# EasyEDA Pro project DRG ST-5 STM32H750VBT6 V1.0_001.eprj

# Schematic DRG ST-5 STM32H750VBT6 V1.0_001
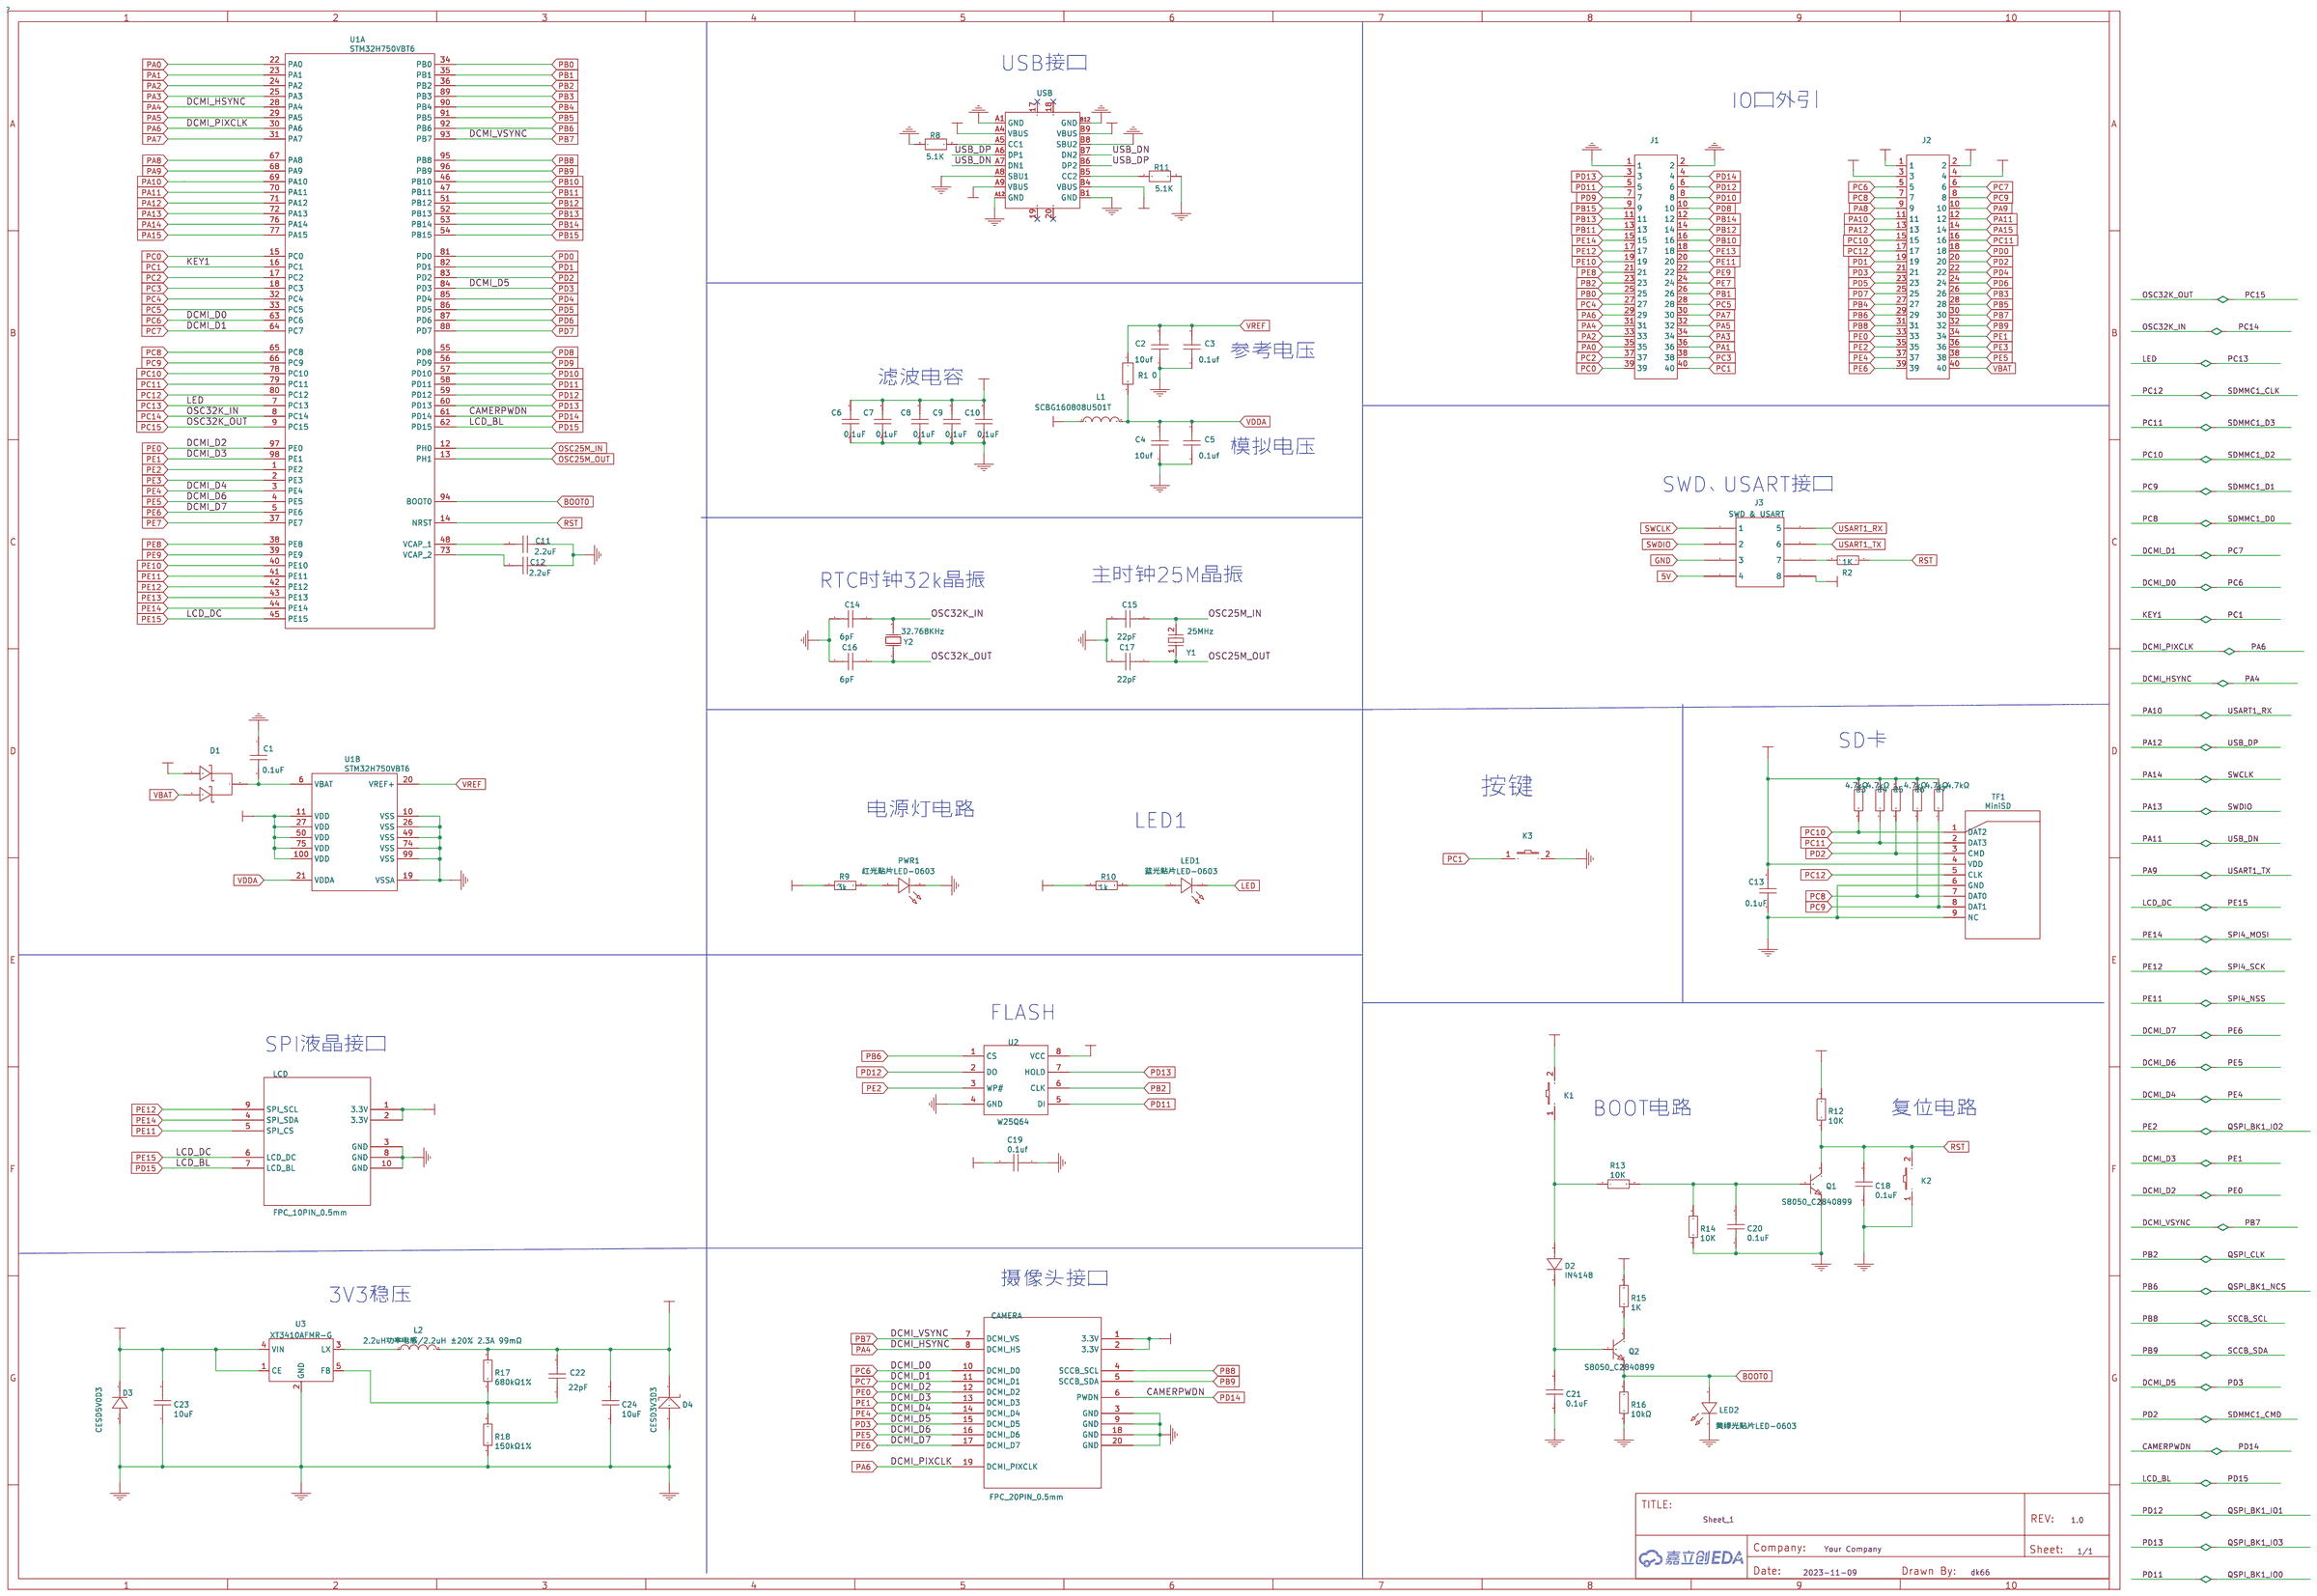
[diagram p0: schematic sheet]

## Parts
C1  0.1uF  [C0603]
C2  10uf  [C0603]
C3  0.1uf  [C0603]
C4  10uf  [C0603]
C5  0.1uf  [C0603]
C6  0.1uF  [C0603]
C7  0.1uF  [C0603]
C8  0.1uF  [C0603]
C9  0.1uF  [C0603]
C10  0.1uF  [C0603]
C11  2.2uF  [C0603]
C12  2.2uF  [C0603]
C13  0.1uF  [C0603]
C14  6pF  [C0603]
C15  22pF  [C0603]
C16  6pF  [C0603]
C17  22pF  [C0603]
C18  0.1uF  [C0603]
C19  0.1uf  [C0603]
C20  0.1uF  [C0603]
C21  0.1uF  [C0603]
C22  22pF  [10UF-C0603]
C23  10uF  [10UF-C0603]
C24  10uF  [10UF-C0603]
CAMERA  FPC_20PIN_0.5mm  [CAMERA]
D1  LBAT54CLT1G  [SOT-23-3_L2.9-W1.3-P1.90-LS2.4-BR]
D2  IN4148  [LL-34_L3.4-W1.5-RD]
D3  CESD5V0D3  [SOD-323_L1.7-W1.3-LS2.6-RD-2]
D4  CESD3V3D3  [SOD-323_L1.8-W1.3-LS2.5-RD]
J1  X6521WV-2×20H-C30D60  [HDR-TH_40P-2.54-V-M-R2-C20-S2.54]
J2  X6521WV-2×20H-C30D60  [HDR-TH_40P-2.54-V-M-R2-C20-S2.54]
J3  SWD & USART  [2X4P-FANKE]
K1  K2-3.6×6.1_SMD  [SW-SMD_L3.9-W3.0-P4.45]
K2  K2-3.6×6.1_SMD  [SW-SMD_L3.9-W3.0-P4.45]
K3  K2-3.6×6.1_SMD  [SW-SMD_L3.9-W3.0-P4.45]
L1  SCBG160808U501T  [L0603]
L2  2.2uH功率电感/2.2uH ±20% 2.3A 99mΩ  [IND-SMD_L2.5-W2.0]
LCD  FPC_10PIN_0.5mm  [FPC10P-0.5MM]
LED1  蓝光贴片LED-0603  [LED0603-RD_RED]
LED2  黄绿光贴片LED-0603  [LED0603-RD_RED]
PWR1  红光贴片LED-0603  [LED0603-RD_RED]
Q1  S8050_C2840899  [SOT-23-3_L2.9-W1.3-P1.90-LS2.4-BR]
Q2  S8050_C2840899  [SOT-23-3_L2.9-W1.3-P1.90-LS2.4-BR]
R1  0  [R0603]
R2  1K  [R0603]
R3  4.7kΩ  [R0603]
R4  4.7kΩ  [R0603]
R5  4.7kΩ  [R0603]
R6  4.7kΩ  [R0603]
R7  4.7kΩ  [R0603]
R8  5.1K  [R0603]
R9  3k  [R0603]
R10  1k  [R0603]
R11  5.1K  [R0603]
R12  10K  [R0603]
R13  10K  [R0603]
R14  10K  [R0603]
R15  1K  [R0603]
R16  10kΩ  [R0603]
R17  680kΩ1%  [R0603]
R18  150kΩ1%  [R0603]
TF1  MiniSD  [MINISD]
U1  STM32H750VBT6  [LQFP-100_14X14X05P]  (sections 1,2)
U2  W25Q64  [SOIC-8_L5.3-W5.3-P1.27-LS8.0-BL]
U3  XT3410AFMR-G  [SOT-23-5_L3.0-W1.7-P0.95-LS2.8-BL]
USB  TYPE-C16PIN母座 板上四脚三次MOLDING  [USB-SMD_TYPE-C16PIN COPY COPY]
Y1  25MHz  [CRYSTAL-SMD_L5.0-W3.2]
Y2  32.768KHz  [OSC-SMD_L3.2-W1.5]

## Library data of the parts
C1 C6-C10 C13 C18 C20 C21 = 0.1uF: Supplier Part: C2168571; Supplier: LCSC; Manufacturer Part: 0603BB104K500NGT; Manufacturer: Knowles(楼氏); JLCPCB Part Class: Extended Part
C2 C4 = 10uf
C3 C5 C19 = 0.1uf
C11 C12 = 2.2uF: Supplier: LCSC; Supplier Part: C458915; Manufacturer: Walsin Tech Corp; Manufacturer Part: 0603X225M6R3CT; JLCPCB Part Class: Extended Part
C14 C16 = 6pF: Supplier: LCSC; Supplier Part: C307356; Manufacturer: Samsung Electro-Mechanics; Manufacturer Part: CL10C100JB81PNC
C15 C17 = 22pF: Supplier: LCSC; Supplier Part: C307356; Manufacturer: Samsung Electro-Mechanics; Manufacturer Part: CL10C100JB81PNC
C22 = 22pF: Supplier: LCSC; Supplier Part: C15415; Manufacturer: Samsung Electro-Mechanics
C23 C24 = 10uF: Supplier: LCSC; Supplier Part: C15415; Manufacturer: Samsung Electro-Mechanics
CAMERA = FPC_20PIN_0.5mm
D1 = LBAT54CLT1G: Supplier: LCSC; Manufacturer: LRC(乐山无线电); Supplier Part: C49991; JLCPCB Part Class: Extended Part
D2 = IN4148: Supplier: LCSC; Supplier Part: C9900023201; Manufacturer: null; JLCPCB Part Class: Extended Part
D3 = CESD5V0D3: Supplier: LCSC; Supplier Part: C2910104; Manufacturer: CJ(江苏长电/长晶); JLCPCB Part Class: Extended Part; link: https://so.szlcsc.com/global.html?k=C2910104&ref=editor
D4 = CESD3V3D3: Supplier: LCSC; Manufacturer: CJ(江苏长电/长晶); Manufacturer Part: CESD3V3D3 YU; Supplier Part: C38388; JLCPCB Part Class: Extended Part
J1 J2 = X6521WV-2×20H-C30D60: Supplier: LCSC; Supplier Part: C725892; Manufacturer: XKB Connectivity(中国星坤); Manufacturer Part: X6521WV-2x20H-C30D60; JLCPCB Part Class: Extended Part
J3 = SWD & USART
K1-K3 = K2-3.6×6.1_SMD: Supplier Part: C118141; Supplier: LCSC; Manufacturer Part: K2-1107ST-A4SW-06; 制造商: 韩国韩荣
L1 = SCBG160808U501T: Supplier: LCSC; Supplier Part: C480859; Manufacturer: Yanchuang(研创); JLCPCB Part Class: Extended Part
L2 = 2.2uH功率电感/2.2uH ±20% 2.3A 99mΩ: Supplier: LCSC; Supplier Part: C315713; Manufacturer: INPAQ(佳邦); Manufacturer Part: WIP252010P-2R2ML; JLCPCB Part Class: Extended Part; link: https://so.szlcsc.com/global.html?k=C315713&ref=editor
LCD = FPC_10PIN_0.5mm
LED1 = 蓝光贴片LED-0603: Supplier: LCSC; Supplier Part: C9900005782; Manufacturer: null; Manufacturer Part: 红光贴片LED-0603; JLCPCB Part Class: Extended Part
LED2 = 黄绿光贴片LED-0603: Supplier: LCSC; Supplier Part: C9900005782; Manufacturer: null; Manufacturer Part: 红光贴片LED-0603; JLCPCB Part Class: Extended Part
PWR1 = 红光贴片LED-0603: Supplier: LCSC; Supplier Part: C9900005782; Manufacturer: null; JLCPCB Part Class: Extended Part
Q1 Q2 = S8050_C2840899: Supplier: LCSC; Supplier Part: C2840899; Manufacturer: PSI(宝力芯); Manufacturer Part: S8050; JLCPCB Part Class: Extended Part; link: https://so.szlcsc.com/global.html?k=C2840899&ref=editor
R1 = 0
R2 = 1K: Supplier: LCSC; Supplier Part: C328340; Manufacturer: ResistorToday; Manufacturer Part: AECR0603F1K00K9; JLCPCB Part Class: Extended Part
R3-R7 = 4.7kΩ: Supplier: LCSC; Supplier Part: C269694; Manufacturer: Tyohm; Manufacturer Part: RMC06034.7k5%N; Resistance: 4.7K; JLCPCB Part Class: Extended Part
R8 R11 = 5.1K
R9 = 3k: Supplier: LCSC; Manufacturer: LIZ; Manufacturer Part: CR0603FA4701G; Supplier Part: C101062
R10 = 1k: Supplier: LCSC; Manufacturer: LIZ; Manufacturer Part: CR0603FA4701G; Supplier Part: C101062
R12-R14 = 10K: Supplier: LCSC; Supplier Part: C328422; Manufacturer: ResistorToday; Manufacturer Part: PTFR0603B1K00P9
R15 = 1K: Supplier: LCSC; Supplier Part: C328422; Manufacturer: ResistorToday; Manufacturer Part: PTFR0603B1K00P9
R16 = 10kΩ: Supplier: LCSC; Supplier Part: C328417; Manufacturer: ResistorToday; Manufacturer Part: PTFR0402B10K0N9; Resistance: 10K; JLCPCB Part Class: Extended Part
R17 = 680kΩ1%: Supplier: LCSC; Supplier Part: C328417; Manufacturer: ResistorToday; Manufacturer Part: PTFR0402B10K0N9; Resistance: 10K; JLCPCB Part Class: Extended Part
R18 = 150kΩ1%: Supplier: LCSC; Supplier Part: C328417; Manufacturer: ResistorToday; Manufacturer Part: PTFR0402B10K0N9; Resistance: 10K; JLCPCB Part Class: Extended Part
TF1 = MiniSD
U1 = STM32H750VBT6: Supplier Part: C117815; Supplier: LCSC; Manufacturer: STMicroelectronics; Manufacturer Part: STM32F427VGT6
U2 = W25Q64: Supplier: LCSC; Manufacturer Part: ?; Supplier Part: C110643
U3 = XT3410AFMR-G: Supplier: LCSC; Supplier Part: C190829; Manufacturer: natlinear(南麟); JLCPCB Part Class: Extended Part
USB = TYPE-C16PIN母座 板上四脚三次MOLDING: Supplier: LCSC; Supplier Part: C9900000202; Manufacturer: null; Manufacturer Part: TYPE-C16PIN母座 板上四脚三次molding; JLCPCB Part Class: Extended Part; link: https://so.szlcsc.com/global.html?k=C9900000202&ref=editor
Y1 = 25MHz: Supplier: LCSC; Supplier Part: C1986844; Manufacturer: NDK; Manufacturer Part: NX5032GA-25MHZ-EXS00A-CG07041; JLCPCB Part Class: Extended Part; link: https://so.szlcsc.com/global.html?k=C1986844&ref=editor
Y2 = 32.768KHz: Supplier: LCSC; Supplier Part: C280830; Manufacturer: Nihon Dempa Kogyo; Manufacturer Part: EXS00A-MU00202

## Nets
3V3: C6.2 C7.2 C8.2 C9.2 C10.2 C13.2 C19.2 C22.2 C24.2 CAMERA.1(3.3V) CAMERA.2(3.3V) D1.1(A1) D4.1 J2.3 J2.4 J3.8 K1.2 L1.1 L2.2 LCD.1(3.3V) LCD.2(3.3V) R3.1 R4.2 R5.2 R6.2 R7.2 R9.1 R10.1 R12.2 R15.1 R17.2 TF1.4(VDD) U1.11(VDD) U1.27(VDD) U1.50(VDD) U1.75(VDD) U1.100(VDD) U2.8(VCC)
5V: C23.2 D3.1(K) J2.1 J2.2 J3.4 U3.1(CE) U3.4(VIN) USB.A4(VBUS) USB.A9(VBUS) USB.B4(VBUS) USB.B9(VBUS)
GND: C1.1 C2.1 C3.1 C4.1 C5.1 C6.1 C7.1 C8.1 C9.1 C10.1 C11.2 C12.1 C13.1 C14.2 C15.2 C16.2 C17.2 C18.1 C19.1 C20.1 C21.1 C23.1 C24.1 CAMERA.3(GND) CAMERA.9(GND) CAMERA.18(GND) CAMERA.20(GND) D3.2(A) D4.2 J1.1 J1.2 J3.3 K2.1 K3.2 LCD.3(GND) LCD.8(GND) LCD.10(GND) LED2.1(K) PWR1.1(K) Q1.2(E) R8.1 R11.2 R14.2 R16.1 R18.1 TF1.6(GND) TF1.9(NC) U1.10(VSS) U1.19(VSSA) U1.26(VSS) U1.49(VSS) U1.74(VSS) U1.99(VSS) U2.4(GND) U3.2(GND) USB.A1(GND) USB.A8(SBU1) USB.A12(GND) USB.B1(GND) USB.B8(SBU2) USB.B12(GND)
VBAT: D1.2(A2) J2.40
VDDA: C4.2 C5.2 L1.2 R1.2 U1.21(VDDA)
BOOT0: LED2.2(A) Q2.2(E) R16.2 U1.94(BOOT0)
CAMERPWDN: CAMERA.6(PWDN) J1.4 U1.61(PD14)
DCMI_D0: CAMERA.10(DCMI_D0) J2.5 U1.63(PC6)
DCMI_D1: CAMERA.11(DCMI_D1) J2.6 U1.64(PC7)
DCMI_D2: CAMERA.12(DCMI_D2) J2.33 U1.97(PE0)
DCMI_D3: CAMERA.13(DCMI_D3) J2.34 U1.98(PE1)
DCMI_D4: CAMERA.14(DCMI_D4) J2.37 U1.3(PE4)
DCMI_D5: CAMERA.15(DCMI_D5) J2.21 U1.84(PD3)
DCMI_D6: CAMERA.16(DCMI_D6) J2.38 U1.4(PE5)
DCMI_D7: CAMERA.17(DCMI_D7) J2.39 U1.5(PE6)
DCMI_HSYNC: CAMERA.8(DCMI_HS) J1.31 U1.28(PA4)
DCMI_PIXCLK: CAMERA.19(DCMI_PIXCLK) J1.29 U1.30(PA6)
DCMI_VSYNC: CAMERA.7(DCMI_VS) J2.30 U1.93(PB7)
KEY1: J1.40 K3.1 U1.16(PC1)
LCD_BL: LCD.7(LCD_BL) U1.62(PD15)
LCD_DC: LCD.6(LCD_DC) U1.45(PE15)
LED: LED1.1(K) U1.7(PC13)
OSC25M_IN: C15.1 U1.12(PH0) Y1.2(GND)
OSC25M_OUT: C17.1 U1.13(PH1) Y1.1
OSC32K_IN: C14.1 U1.8(PC14) Y2.2(OSC2)
OSC32K_OUT: C16.1 U1.9(PC15) Y2.1(OSC1)
PA0: J1.35 U1.22(PA0)
PA1: J1.36 U1.23(PA1)
PA2: J1.33 U1.24(PA2)
PA3: J1.34 U1.25(PA3)
PA5: J1.32 U1.29(PA5)
PA7: J1.30 U1.31(PA7)
PA8: J2.9 U1.67(PA8)
PA9: J2.10 J3.6 U1.68(PA9)
PA10: J2.11 J3.5 U1.69(PA10)
PA11: J2.12 U1.70(PA11) USB.A7(DN1) USB.B7(DN2)
PA12: J2.13 U1.71(PA12) USB.A6(DP1) USB.B6(DP2)
PA13: J3.2 U1.72(PA13)
PA14: J3.1 U1.76(PA14)
PA15: J2.14 U1.77(PA15)
PB0: J1.25 U1.34(PB0)
PB1: J1.26 U1.35(PB1)
PB2: J1.23 U1.36(PB2) U2.6(CLK)
PB3: J2.26 U1.89(PB3)
PB4: J2.27 U1.90(PB4)
PB5: J2.28 U1.91(PB5)
PB6: J2.29 U1.92(PB6) U2.1(CS)
PB8: CAMERA.4(SCCB_SCL) J2.31 U1.95(PB8)
PB9: CAMERA.5(SCCB_SDA) J2.32 U1.96(PB9)
PB10: J1.16 U1.46(PB10)
PB11: J1.13 U1.47(PB11)
PB12: J1.14 U1.51(PB12)
PB13: J1.11 U1.52(PB13)
PB14: J1.12 U1.53(PB14)
PB15: J1.9 U1.54(PB15)
PC0: J1.39 U1.15(PC0)
PC2: J1.37 U1.17(PC2)
PC3: J1.38 U1.18(PC3)
PC4: J1.27 U1.32(PC4)
PC5: J1.28 U1.33(PC5)
PC8: J2.7 R6.1 TF1.7(DAT0) U1.65(PC8)
PC9: J2.8 R7.1 TF1.8(DAT1) U1.66(PC9)
PC10: J2.15 R3.2 TF1.1(DAT2) U1.78(PC10)
PC11: J2.16 R4.1 TF1.2(DAT3) U1.79(PC11)
PC12: J2.17 TF1.5(CLK) U1.80(PC12)
PD0: J2.18 U1.81(PD0)
PD1: J2.19 U1.82(PD1)
PD2: J2.20 R5.1 TF1.3(CMD) U1.83(PD2)
PD4: J2.22 U1.85(PD4)
PD5: J2.23 U1.86(PD5)
PD6: J2.24 U1.87(PD6)
PD7: J2.25 U1.88(PD7)
PD8: J1.10 U1.55(PD8)
PD9: J1.7 U1.56(PD9)
PD10: J1.8 U1.57(PD10)
PD11: J1.5 U1.58(PD11) U2.5(DI)
PD12: J1.6 U1.59(PD12) U2.2(DO)
PD13: J1.3 U1.60(PD13) U2.7(HOLD)
PE2: J2.35 U1.1(PE2) U2.3(WP#)
PE3: J2.36 U1.2(PE3)
PE7: J1.24 U1.37(PE7)
PE8: J1.21 U1.38(PE8)
PE9: J1.22 U1.39(PE9)
PE10: J1.19 U1.40(PE10)
PE11: J1.20 LCD.5(SPI_CS) U1.41(PE11)
PE12: J1.17 LCD.9(SPI_SCL) U1.42(PE12)
PE13: J1.18 U1.43(PE13)
PE14: J1.15 LCD.4(SPI_SDA) U1.44(PE14)
RST: C18.2 K2.2 Q1.3(C) R2.1 R12.1 U1.14(NRST)
VREF: C2.2 C3.2 R1.1 U1.20(VREF+)
D2_2: D2.2(A) K1.1 R13.1
L2_1: L2.1 U3.3(LX)
LED1_2: LED1.2(A) R10.2
PWR1_2: PWR1.2(A) R9.2
Q1_1: C20.2 Q1.1(B) R13.2 R14.1
Q2_1: C21.2 D2.1(K) Q2.1(B)
R2_2: J3.7 R2.2
R8_2: R8.2 USB.A5(CC1)
R11_1: R11.1 USB.B5(CC2)
R15_2: Q2.3(C) R15.2
R18_2: C22.1 R17.1 R18.2 U3.5(FB)
U1_6: C1.2 D1.3(K) U1.6(VBAT)
U1_48: C11.1 U1.48(VCAP_1)
U1_73: C12.2 U1.73(VCAP_2)

Not connected (* = marked no-connect by the designer): USB 17* 18* 19* 20*

## Notes on the sheet
- USB接口
- IO口外引
- 参考电压
- 滤波电容
- 模拟电压
- SWD、USART接口
- RTC时钟32k晶振
- 主时钟25M晶振
- SD卡
- 按键
- 电源灯电路
- LED1
- FLASH
- SPI液晶接口
- BOOT电路
- 复位电路
- 摄像头接口
- 3V3稳压

# Board DRG ST-5 STM32H750VBT6 V1.0_001-PCB
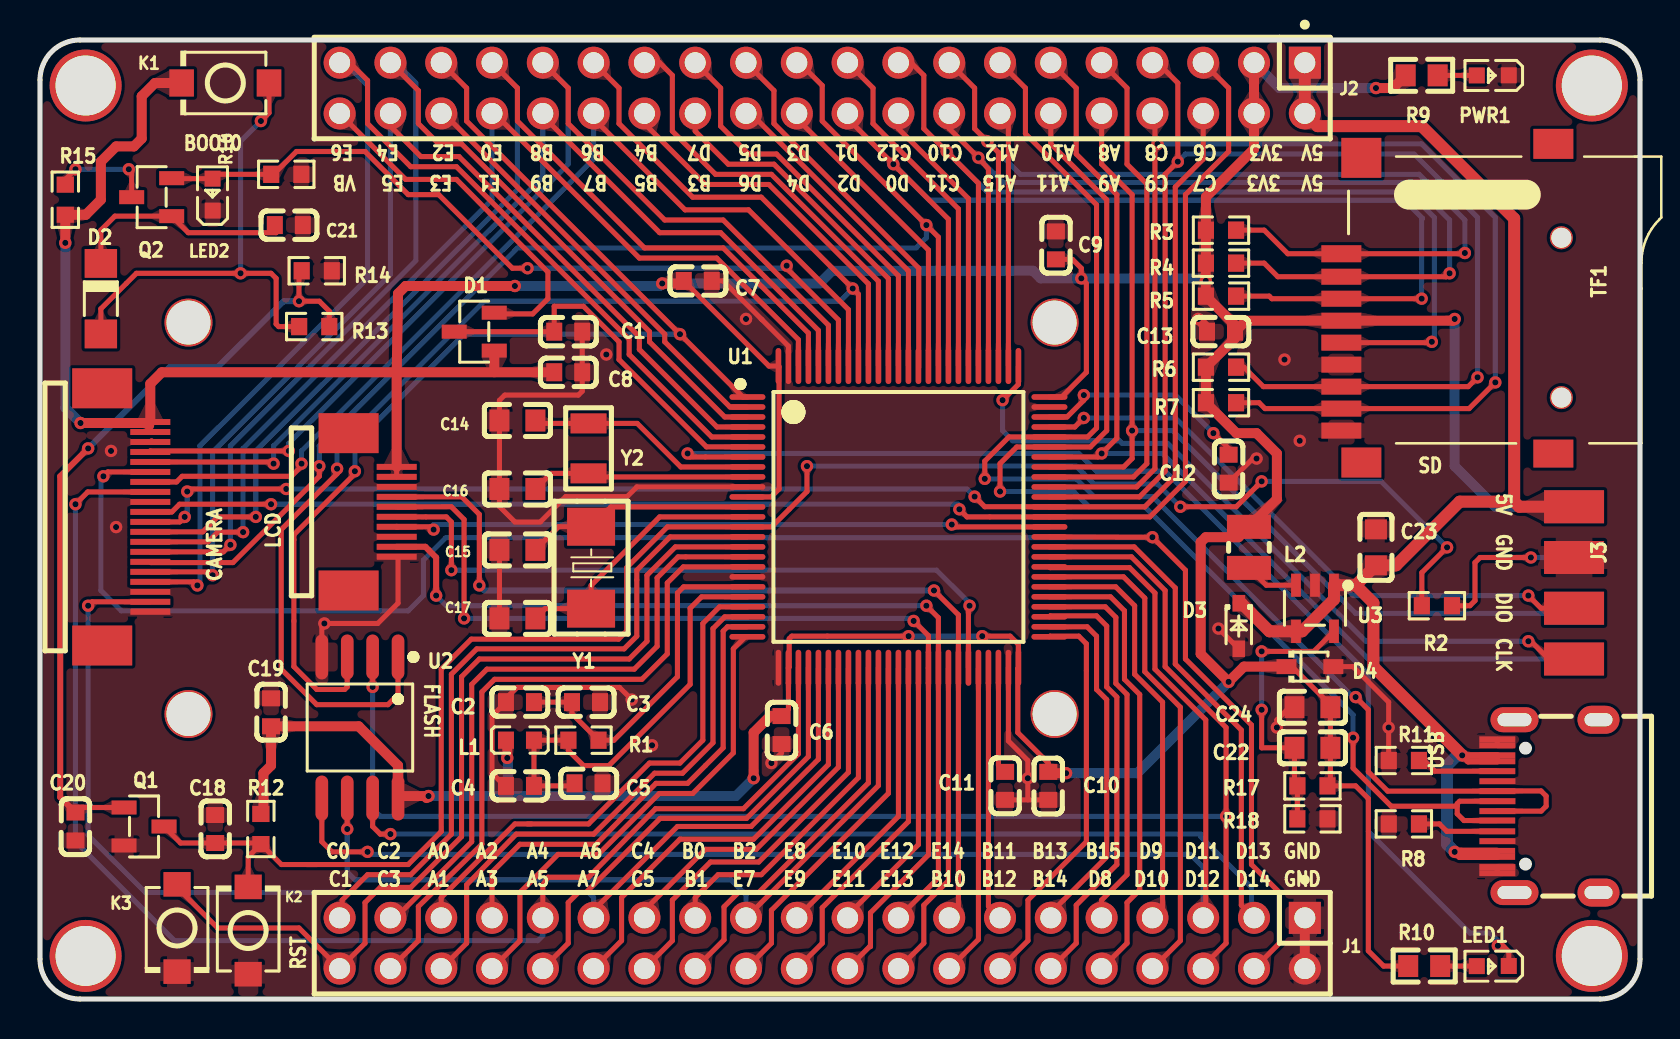
[diagram p1: board, top side]
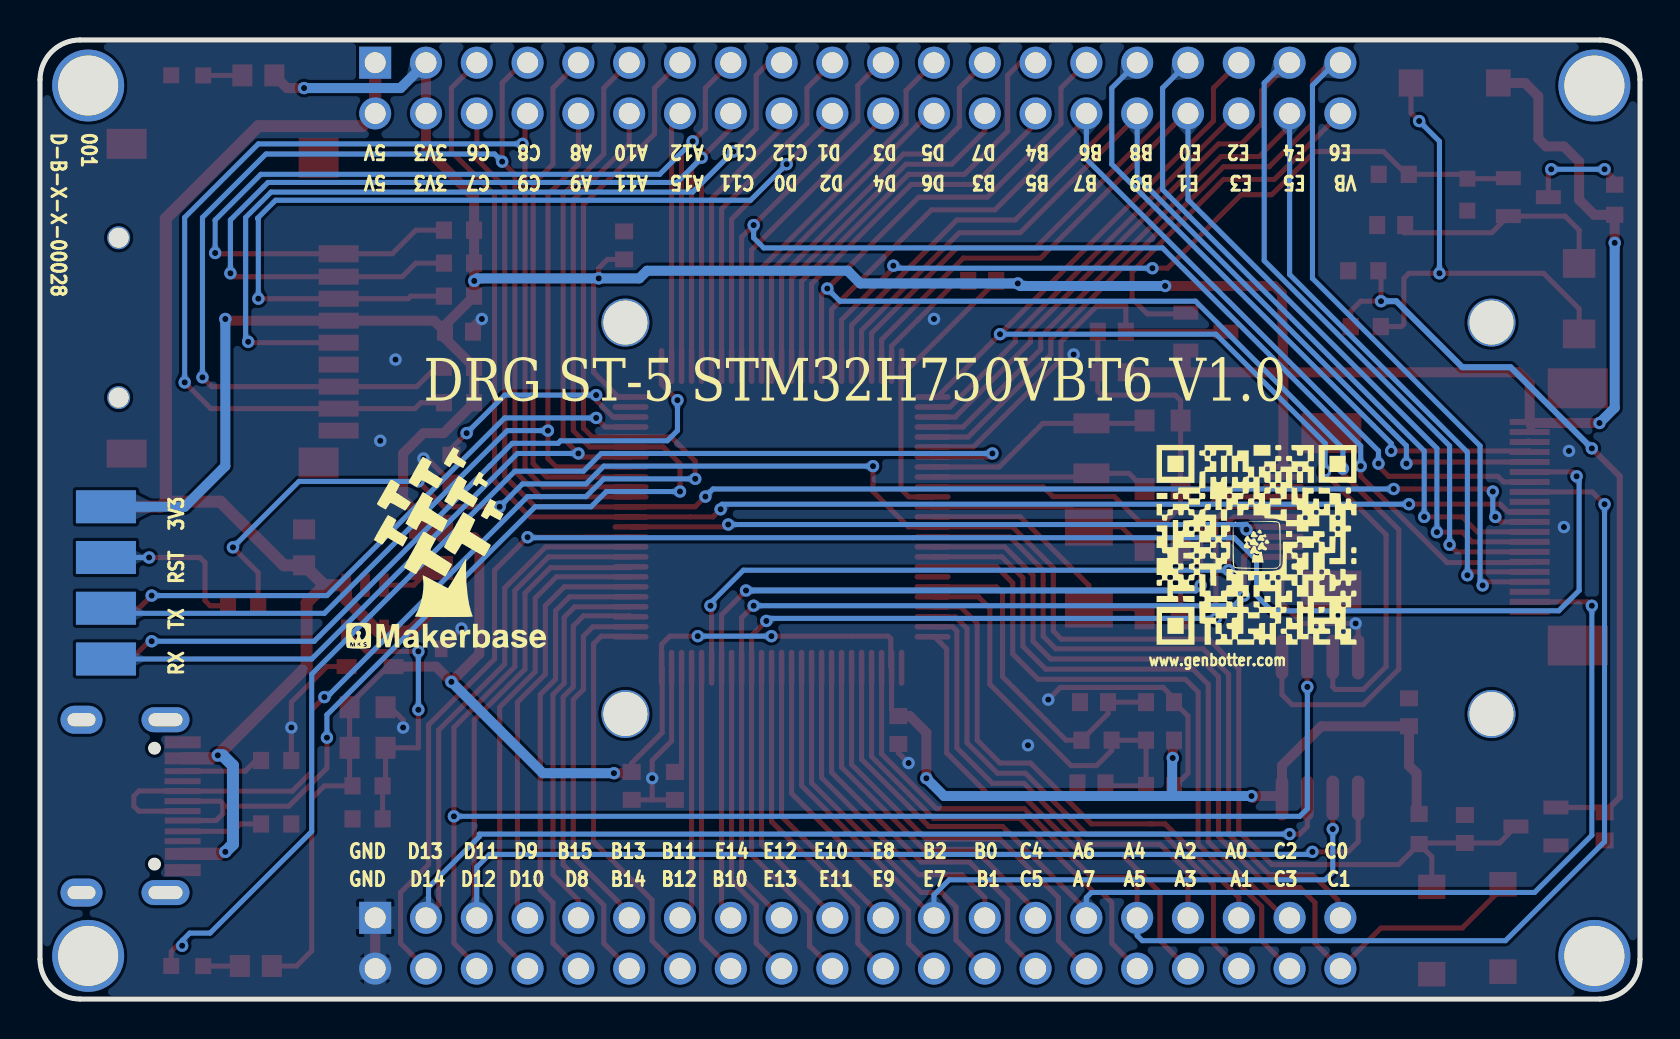
[diagram p2: board, bottom side, seen from below]

Outline 80 x 48 mm; copper layers: Top Layer, Bottom Layer. Coordinates in mm from the lower left corner of the outline.
Outline path: 0,46 arc(0.59,47.41) 2,48 78,48 arc(79.41,47.41) 80,46 80,2 arc(79.41,0.59) 78,0 2,0 arc(0.59,0.59) 0,2 0,46
Stack: Top Layer 0.035mm / Dielectric1 1.51mm FR4 er 4.5 / Bottom Layer 0.035mm

## Design rules (mm)
spacing Default (default): track to track 0.152, other pairs 0 to 0.152
track width Default (default): min 0.254, default 0.254, max 25.4
differential pair differentialPair (default): width min 0.127, default 0.254, max 2.54; gap min 0.152, default 0.152
via Default (default): diameter min 0.61, default 0.61, max 100.025; hole min 0.305, default 0.305, max 59.995
pour e342 uses gge136194
pour e2032 uses gge136125

## Placement (name value [footprint] x y rotation side)
C1  0.1uF  [C0603]  26.41 33.4 180 top
C2  10uf  [C0603]  24 14.86 0 top
C3  0.1uf  [C0603]  27.3 14.86 180 top
C4  10uf  [C0603]  24 10.67 0 top
C5  0.1uf  [C0603]  27.43 10.79 180 top
C6  0.1uF  [C0603]  37.08 13.46 90 top
C7  0.1uF  [C0603]  32.89 35.94 180 top
C8  0.1uF  [C0603]  26.41 31.37 180 top
C9  0.1uF  [C0603]  50.8 37.72 270 top
C10  0.1uF  [C0603]  50.41 10.67 90 top
C11  2.2uF  [C0603]  48.25 10.67 270 top
C12  2.2uF  [C0603]  59.43 26.54 90 top
C13  0.1uF  [C0603]  59.05 33.4 0 top
C14  6pF  [C0603#2]  23.87 28.96 180 top
C15  22pF  [C0603#2]  23.87 22.48 180 top
C16  6pF  [C0603#2]  23.87 25.53 180 top
C17  22pF  [C0603#2]  23.87 19.05 180 top
C18  0.1uF  [C0603]  8.76 8.51 270 top
C19  0.1uf  [C0603]  11.55 14.35 270 top
C20  0.1uF  [C0603]  1.77 8.64 90 top
C21  0.1uF  [C0603]  12.44 38.73 180 top
C22  22pF  [10UF-C0603]  63.62 12.57 0 top
C23  10uF  [10UF-C0603]  66.8 22.61 270 top
C24  10uF  [10UF-C0603]  63.62 14.6 0 top
CAMERA  FPC_20PIN_0.5mm  [CAMERA]  4.31 24.13 90 top
D1  LBAT54CLT1G  [SOT-23-3_L2.9-W1.3-P1.90-LS2.4-BR]  21.71 33.4 0 top
D2  IN4148  [LL-34_L3.4-W1.5-RD]  3.04 35.05 270 top
D3  CESD5V0D3  [SOD-323_L1.7-W1.3-LS2.6-RD-2]  59.94 18.67 270 top
D4  CESD3V3D3  [SOD-323_L1.8-W1.3-LS2.5-RD]  63.5 16.64 0 top
J1  X6521WV-2×20H-C30D60  [HDR-TH_40P-2.54-V-M-R2-C20-S2.54]  39.11 2.79 180 top
J2  X6521WV-2×20H-C30D60  [HDR-TH_40P-2.54-V-M-R2-C20-S2.54]  39.11 45.59 180 top
J3  SWD & USART  [2X4P-FANKE]  76.7 20.7 0 top
K1  K2-3.6×6.1_SMD  [SW-SMD_L3.9-W3.0-P4.45]  9.27 45.85 180 top
K2  K2-3.6×6.1_SMD  [SW-SMD_L3.9-W3.0-P4.45]  10.41 3.43 90 top
K3  K2-3.6×6.1_SMD  [SW-SMD_L3.9-W3.0-P4.45]  6.85 3.56 270 top
L1  SCBG160808U501T  [L0603]  24 12.95 0 top
L2  2.2uH功率电感/2.2uH ±20% 2.3A 99mΩ  [IND-SMD_L2.5-W2.0]  60.45 22.61 270 top
LCD  FPC_10PIN_0.5mm  [FPC10P-0.5MM]  15.36 24.51 90 top
LED1  蓝光贴片LED-0603  [LED0603-RD_RED]  72.64 1.65 180 top
LED2  黄绿光贴片LED-0603  [LED0603-RD_RED]  8.63 40.26 90 top
NOREF  -  [Pad_ie3503]  77.59 2.16 0 top
NOREF#2  -  [Pad_ie3500]  2.28 2.16 0 top
NOREF#3  -  [Pad_ie3501]  2.28 45.72 0 top
NOREF#4  -  [Pad_ie3502]  77.59 45.72 0 top
PWR1  红光贴片LED-0603  [LED0603-RD_RED]  72.64 46.23 180 top
Q1  S8050_C2840899  [SOT-23-3_L2.9-W1.3-P1.90-LS2.4-BR]  5.2 8.64 180 top
Q2  S8050_C2840899  [SOT-23-3_L2.9-W1.3-P1.90-LS2.4-BR]  5.58 40.13 0 top
R1  0  [R0603]  27.17 12.95 180 top
R2  1K  [R0603]  69.84 19.68 0 top
R3  4.7kΩ  [R0603]  59.05 38.48 0 top
R4  4.7kΩ  [R0603]  59.05 36.83 180 top
R5  4.7kΩ  [R0603]  59.05 35.18 180 top
R6  4.7kΩ  [R0603]  59.05 31.62 180 top
R7  4.7kΩ  [R0603]  59.05 29.84 180 top
R8  5.1K  [R0603]  68.19 8.76 0 top
R9  3k  [R0603#2]  69.08 46.23 0 top
R10  1k  [R0603#2]  69.21 1.65 0 top
R11  5.1K  [R0603]  68.19 11.94 180 top
R12  10K  [R0603]  11.04 8.51 90 top
R13  10K  [R0603]  13.71 33.65 0 top
R14  10K  [R0603]  13.84 36.45 0 top
R15  1K  [R0603]  1.27 40 90 top
R16  10kΩ  [R0603]  12.31 41.27 180 top
R17  680kΩ1%  [R0603]  63.62 10.67 0 top
R18  150kΩ1%  [R0603]  63.62 9.02 180 top
T2  _  [footprint_07af]  29.08 25.27 0 top
TF1  MiniSD  [MINISD]  72.38 34.67 270 top
U1  STM32H750VBT6  [LQFP-100_14X14X05P]  42.92 24.13 0 top
U2  W25Q64  [SOIC-8_L5.3-W5.3-P1.27-LS8.0-BL]  16 13.59 180 top
U3  XT3410AFMR-G  [SOT-23-5_L3.0-W1.7-P0.95-LS2.8-BL]  63.75 19.56 180 top
USB  TYPE-C16PIN母座 板上四脚三次MOLDING  [USB-SMD_TYPE-C16PIN COPY COPY]  75.56 9.65 90 top
Y1  25MHz  [CRYSTAL-SMD_L5.0-W3.2]  27.55 21.59 90 top
Y2  32.768KHz  [OSC-SMD_L3.2-W1.5]  27.43 27.56 90 top

## Footprints (pads in the part's own frame, mm; a bottom-side part is the same pattern mirrored in y, then rotated)
2X4P-FANKE
  rect 3x1.65 smd: 1(0,-3.683) 2(0,-1.143) 3(0,1.397) 4(0,3.937)
  rect 3x1.65 smd far side: 5(0,-3.683) 6(0,-1.143) 7(0,1.397) 8(0,3.937)
10UF-C0603
  rect 1x1.1 smd: 1(-0.9,0) 2(0.9,0)
C0603
  rect 0.8x0.9 smd: 1(-0.7,0) 2(0.7,0)
C0603#2
  rect 1x1.1 smd: 1(-0.9,0) 2(0.9,0)
CAMERA
  rect 2x3 smd: 0(-6.436,1.202) 0(6.436,1.202)
  rect 0.3x2 smd: 1(4.75,-1.202) 2(4.25,-1.202) 3(3.749,-1.202) 4(3.249,-1.202) 5(2.749,-1.202) 6(2.249,-1.202) 7(1.75,-1.202) 8(1.25,-1.202) 9(0.75,-1.202) 10(0.249,-1.202) 11(-0.251,-1.202) 12(-0.75,-1.202) 13(-1.25,-1.202) 14(-1.75,-1.202) 15(-2.251,-1.202) 16(-2.751,-1.202) 17(-3.251,-1.202) 18(-3.751,-1.202) 19(-4.25,-1.202) 20(-4.75,-1.202)
CRYSTAL-SMD_L5.0-W3.2
  rect 1.9x2.4 smd: 1(-2.05,0) 2(2.05,0)
footprint_07af
  round 2.4 hole 2.2: 150(-21.654,8.582) 150(-21.654,-11.008) 152(21.654,8.582) 152(21.654,-11.008)
FPC10P-0.5MM
  rect 2x3 smd: 0(-4.064,-0.068) 0(3.809,-0.068)
  rect 0.3x2 smd: 1(2.123,-2.473) 2(1.623,-2.473) 3(1.123,-2.473) 4(0.623,-2.473) 5(0.122,-2.473) 6(-0.378,-2.473) 7(-0.877,-2.473) 8(-1.377,-2.473) 9(-1.877,-2.473) 10(-2.377,-2.473)
HDR-TH_40P-2.54-V-M-R2-C20-S2.54
  rect 1.6x1.6 hole 1.05: 1(-24.13,-1.27)
  round 1.6 hole 1.05: 2(-24.13,1.27) 3(-21.59,-1.27) 4(-21.59,1.27) 5(-19.05,-1.27) 6(-19.05,1.27) 7(-16.51,-1.27) 8(-16.51,1.27) 9(-13.97,-1.27) 10(-13.97,1.27) 11(-11.43,-1.27) 12(-11.43,1.27) 13(-8.89,-1.27) 14(-8.89,1.27) 15(-6.35,-1.27) 16(-6.35,1.27) 17(-3.81,-1.27) 18(-3.81,1.27) 19(-1.27,-1.27) 20(-1.27,1.27) 21(1.27,-1.27) 22(1.27,1.27) 23(3.81,-1.27) 24(3.81,1.27) 25(6.35,-1.27) 26(6.35,1.27) 27(8.89,-1.27) 28(8.89,1.27) 29(11.43,-1.27) 30(11.43,1.27) 31(13.97,-1.27) 32(13.97,1.27) 33(16.51,-1.27) 34(16.51,1.27) 35(19.05,-1.27) 36(19.05,1.27) 37(21.59,-1.27) 38(21.59,1.27) 39(24.13,-1.27) 40(24.13,1.27)
IND-SMD_L2.5-W2.0
  rect 1.2x2.2 smd: 1(1.028,0) 2(-1.028,0)
L0603
  rect 0.8x0.864 smd: 1(-0.7,0) 2(0.7,0)
LED0603-RD_RED
  rect 0.8x0.8 smd: 1(-0.799,-0.004) 2(0.799,0.004)
LL-34_L3.4-W1.5-RD
  rect 1.44x1.62 smd: 1(-1.765,0) 2(1.765,0)
LQFP-100_14X14X05P
  oval 1.8x0.28 smd: 1(-7.55,6) 2(-7.55,5.5) 3(-7.55,5) 4(-7.55,4.5) 5(-7.55,4) 6(-7.55,3.5) 7(-7.55,3) 8(-7.55,2.5) 9(-7.55,2) 10(-7.55,1.5) 11(-7.55,1) 12(-7.55,0.5) 13(-7.55,0) 14(-7.55,-0.5) 15(-7.55,-1) 16(-7.55,-1.5) 17(-7.55,-2) 18(-7.55,-2.5) 19(-7.55,-3) 20(-7.55,-3.5) 21(-7.55,-4) 22(-7.55,-4.5) 23(-7.55,-5) 24(-7.55,-5.5) 25(-7.55,-6) 51(7.55,-6) 52(7.55,-5.5) 53(7.55,-5) 54(7.55,-4.5) 55(7.55,-4) 56(7.55,-3.5) 57(7.55,-3) 58(7.55,-2.5) 59(7.55,-2) 60(7.55,-1.5) 61(7.55,-1) 62(7.55,-0.5) 63(7.55,0) 64(7.55,0.5) 65(7.55,1) 66(7.55,1.5) 67(7.55,2) 68(7.55,2.5) 69(7.55,3) 70(7.55,3.5) 71(7.55,4) 72(7.55,4.5) 73(7.55,5) 74(7.55,5.5) 75(7.55,6)
  oval 0.28x1.8 smd: 26(-6,-7.55) 27(-5.5,-7.55) 28(-5,-7.55) 29(-4.5,-7.55) 30(-4,-7.55) 31(-3.5,-7.55) 32(-3,-7.55) 33(-2.5,-7.55) 34(-2,-7.55) 35(-1.5,-7.55) 36(-1,-7.55) 37(-0.5,-7.55) 38(0,-7.55) 39(0.5,-7.55) 40(1,-7.55) 41(1.5,-7.55) 42(2,-7.55) 43(2.5,-7.55) 44(3,-7.55) 45(3.5,-7.55) 46(4,-7.55) 47(4.5,-7.55) 48(5,-7.55) 49(5.5,-7.55) 50(6,-7.55) 76(6,7.55) 77(5.5,7.55) 78(5,7.55) 79(4.5,7.55) 80(4,7.55) 81(3.5,7.55) 82(3,7.55) 83(2.5,7.55) 84(2,7.55) 85(1.5,7.55) 86(1,7.55) 87(0.5,7.55) 88(0,7.55) 89(-0.5,7.55) 90(-1,7.55) 91(-1.5,7.55) 92(-2,7.55) 93(-2.5,7.55) 94(-3,7.55) 95(-3.5,7.55) 96(-4,7.55) 97(-4.5,7.55) 98(-5,7.55) 99(-5.5,7.55) 100(-6,7.55)
MINISD
  rect 1.5x2 smd: (-8.129,3.282)
  rect 2x2 smd: (-7.429,-6.317)
  rect 1.4x2 smd: (7.371,3.282)
  custom 1.501x1.998 smd: (7.821,-6.317)
  round 1.15 hole 1: 0(-3.429,3.682) 0(4.571,3.682)
  rect 0.85x2 smd: 1(-2.629,-7.317)
  rect 0.8x2 smd: 2(-1.479,-7.317) 3(-0.379,-7.317) 4(0.721,-7.317) 5(1.821,-7.317) 6(2.921,-7.317) 7(4.021,-7.317) 8(5.121,-7.317) 9(6.221,-7.317)
OSC-SMD_L3.2-W1.5
  rect 1x1.8 smd: 1(-1.25,0) 2(1.25,0)
Pad_ie3500
  round 3.6 hole 3.005x3: 145(0,0)
Pad_ie3501
  round 3.6 hole 3.005x3: 145(0,0)
Pad_ie3502
  round 3.6 hole 3.005x3: 145(0,0)
Pad_ie3503
  round 3.6 hole 3.005x3: 145(0,0)
R0603
  rect 0.806x0.864 smd: 1(-0.753,0) 2(0.753,0)
R0603#2
  rect 1x1.1 smd: 1(-0.8,0) 2(0.8,0)
SOD-323_L1.7-W1.3-LS2.6-RD-2
  rect 0.83x0.63 smd: 1(-1.14,0) 2(1.14,0)
SOD-323_L1.8-W1.3-LS2.5-RD
  rect 1x0.75 smd: 1(-1.173,0) 2(1.173,0)
SOIC-8_L5.3-W5.3-P1.27-LS8.0-BL
  oval 0.63x2.25 smd: 1(-1.905,-3.53) 2(-0.635,-3.53) 3(0.635,-3.53) 4(1.905,-3.53) 5(1.905,3.53) 6(0.635,3.53) 7(-0.635,3.53) 8(-1.905,3.53)
SOT-23-3_L2.9-W1.3-P1.90-LS2.4-BR
  rect 1.25x0.7 smd: 1(1,-0.95) 2(1,0.95) 3(-1,0)
SOT-23-5_L3.0-W1.7-P0.95-LS2.8-BL
  rect 0.49x1.157 smd: 1(-0.95,-1.153) 2(0,-1.153) 3(0.95,-1.153)
  rect 0.49x1.175 smd: 4(0.95,1.153) 5(-0.95,1.153)
SW-SMD_L3.9-W3.0-P4.45
  rect 1.23x1.36 smd: 1(-2.185,0) 2(2.185,0)
USB-SMD_TYPE-C16PIN COPY COPY
  oval 1.25x2.4 hole 0.65x1.7: 17(-4.325,1.835) 18(4.325,1.835)
  oval 1.4x2.1 hole 0.65x1.4: 19(-4.325,-2.365) 20(4.325,-2.365)
  rect 0.3x1.8 smd: A1(-3.352,2.696) A4(-2.536,2.704) A5(-1.26,2.7) A6(-0.248,2.688) A7(0.248,2.688) A8(1.248,2.688) A9(2.544,2.696) A12(3.344,2.696) B1(3.048,2.696) B4(2.248,2.696) B5(1.752,2.696) B6(0.752,2.688) B7(-0.72,2.7) B8(-1.752,2.688) B9(-2.24,2.704) B12(-3.048,2.696)

## Nets
As in the schematic, except:
PA4: CAMERA.8 J1.31 U1.28
PA6: CAMERA.19 J1.29 U1.30
PB7: CAMERA.7 J2.30 U1.93
PC1: J1.40 K3.1 U1.16
PC6: CAMERA.10 J2.5 U1.63
PC7: CAMERA.11 J2.6 U1.64
PC13: LED1.1 U1.7
PC14: C14.1 U1.8 Y2.2
PC15: C16.1 U1.9 Y2.1
PD3: CAMERA.15 J2.21 U1.84
PD14: CAMERA.6 J1.4 U1.61
PD15: LCD.7 U1.62
PE0: CAMERA.12 J2.33 U1.97
PE1: CAMERA.13 J2.34 U1.98
PE4: CAMERA.14 J2.37 U1.3
PE5: CAMERA.16 J2.38 U1.4
PE6: CAMERA.17 J2.39 U1.5
PE15: LCD.6 U1.45

Pads without a net: CAMERA 0; LCD 0; NOREF 145; NOREF#2 145; NOREF#3 145; NOREF#4 145; T2 150 152; TF1 0; USB 17 18 19 20

## Via types
v1: diameter 0.62, hole 0.31, Top Layer to Bottom Layer, 113 vias

## Routing (per net, layer and track width the routed paths; a pad name or vN(x,y) marks a point on that pad's centre or on a via; arc(x,y) is an arc through that point)
3V3: length 290.5
  Top Layer w0.254: D4.1 62.61,16.64 64.52,14.72 64.52,10.82 R17.2 65.78,10.67 66.42,10.03 66.42,2.41 67.18,1.65 R10.1 ; C10.2 50.41,11.81 48.89,13.33 48.89,16.55 U1.50 48.92,17.75 48.51,18.16 v1(47.11,18.16) ; 50.8,37.02 51.62,37.02 52.06,36.58 v1(52.06,36.07) 52.32,35.81 52.32,31.37 51.08,30.13 50.47,30.13 ; v1(43.43,18.16) 37.59,18.16 37.46,18.03 37.46,16.62 37.42,16.58 37.42,14.5 37.08,14.16 ; 35.37,25.13 36.56,25.13 36.95,25.53 36.95,31.65 36.92,31.68 36.45,31.68 C7.2 ; 17.83,26.63 LCD.2
  Top Layer w0.5: R12.2 11.17,9.39 11.17,11.3 11.55,11.68 11.55,13.65 15.94,13.65 17.9,11.68 U2.8 18,10.16 v1(19.43,10.16) 19.33,10.06 ; 68.28,46.23 67.65,45.59 v1(66.8,45.59) ; 23.3,12.95 23.36,12.89 v1(23.36,12.06) ; 17.83,26.63 17.83,31.37 ; 17.83,31.37 17.9,35.31 18.28,35.69 v1(23.74,35.69) ; 17.83,31.37 6.09,31.37 5.51,30.79 5.51,28.88 ; 17.83,31.37 25.71,31.37 ; 59.75,33.4 60.3,33.95 TF1.4 70.65,33.95 v1(70.73,34.04) ; 59.75,33.4 59.75,33.73 R5.2 58.29,35.19 v1(58.29,35.94) 58.29,36.82 R4.2 R3.1 58.3,40.14 60.7,42.54 60.7,46.23 61.21,46.74 ; 59.75,33.4 59.75,33.08 R6.2 R7.2 59.82,28.32 60.83,28.32 61.84,27.3 61.84,25.02 L2.2 59.93,23.11 58.29,23.11 58.03,22.86 58.03,17.27 v1(59.43,15.87) 60.19,16.64 D4.1 ; C7.2 32.06,35.81 v1(31.11,35.81) ; v1(2.03,28.83) 5.33,28.83 5.46,28.7 ; v1(35.68,11.05) 35.68,13.33 36.51,14.16 37.08,14.16 ; C10.2 50.48,11.3 v1(51.3,11.3) ; 7.08,45.85 5.75,45.85 5.09,45.18 5.09,43.06 4.69,42.67 3.81,42.67 3.04,41.91 3.04,40 2.29,39.25 1.27,39.25 v1(1.27,37.85) ; D1.1 22.71,31.37
  Bottom Layer w0.254: v1(43.43,18.16) v1(47.11,18.16)
  Bottom Layer w0.5: v1(19.43,10.16) 34.79,10.16 v1(35.68,11.05) ; v1(51.3,11.3) 54.86,11.3 v1(59.43,15.87) ; v1(23.36,12.06) 23.39,12.04 23.39,10.16 ; v1(58.29,35.94) 58.16,36.07 v1(52.06,36.07) 50.03,36.07 49.65,36.45 39.62,36.45 38.98,35.81 v1(31.11,35.81) 30.98,35.69 v1(23.74,35.69) ; v1(2.03,28.83) 1.27,29.59 v1(1.27,37.85) ; v1(70.73,34.04) 70.73,26.67 72.77,24.64 J3.8 ; v1(66.8,45.59) 61.97,45.59 60.7,46.86
5V: length 74.7
  Top Layer w0.254: USB.B4 USB.A9 ; USB.A4 72.86,7.41
  Top Layer w0.32: USB.A9 v1(71.11,12.2) 71.41,11.9 USB.B4 ; 72.86,7.41 70.78,7.41 v1(70.73,7.37) 70.98,7.12 USB.A4
  Top Layer w0.6: 65.78,20.71 66.8,21.71 67.8,21.71 70.99,24.89 73.71,24.89 ; 65.78,20.71 66.67,19.82 66.67,16.64 v1(71.11,12.2) ; 65.78,20.71 64.7,20.71 64.7,20 63.1,18.4 U3.4 61.47,18.4 60.07,19.81 D3.1 ; 73.71,24.89 73.71,39.06 69.08,43.69 63.88,43.69 J2.2 63.24,46.23 63.75,46.74 ; 73.71,24.89 73.96,24.64 J3.4
  Bottom Layer w0.6: v1(71.11,12.2) 70.87,12.2 70.35,11.68 70.35,7.75 v1(70.73,7.37)
GND: length 81.6
  Top Layer w0.254: USB.A1 USB.B12 ; 48.25,9.97 50.41,9.97 ; 27.11,33.4 27.11,30.42 26.92,30.23 23.24,30.23 22.97,29.96 C14.2 C16.2 22.97,24.65 23.74,23.88 25.01,23.88 26.28,25.15 29.36,25.15 29.84,25.63 35.37,25.63 ; v1(60.83,27.05) 60.64,27.05 59.43,25.84 ; v1(61.84,13.59) 61.84,13.97 62.48,14.6 62.72,14.6 ; CAMERA.3 5.58,27.94 ; 36.1,34 34.16,35.94 C7.1 ; 36.1,34 37.42,32.68 37.42,31.68 ; 36.1,34 36.06,34.04 ; R11.2 67.43,11.95 v1(67.43,13.59) 67.43,14.86 65.65,16.64 D4.2 ; LCD.10 17.9,22.06 17.9,19.81 16.89,18.8 v1(14.22,18.8) 14.09,18.67 U2.4 ; C6.1 37.08,12.32 v1(36.57,11.81) ; v1(29.59,14.99) 28.98,15.6 23.85,15.6 23.3,15.05 23.3,14.86 22.6,14.16 22.6,11.3 23.24,10.67 23.3,10.67 ; C15.2 C17.2 ; D3.2 58.93,18.54 v1(58.92,18.54) ; C3.1 28.13,14.99 ; 49.39,9.97 v1(49.39,11.05) 49.39,11.94 48.42,12.92 U1.49 ; 58.35,33.4 58.29,33.46 ; USB.B1 USB.A12
  Top Layer w0.5: J1.1 J1.2 ; 58.35,33.4 58.35,33.59 v1(57.91,34.04)
  vias: v1(3.55,27.43) v1(3.81,23.62) v1(28.32,32.26) v1(30.6,12.7) v1(35.3,34.04) v1(62.22,32) v1(62.99,27.94)
VBAT: length 18
  Top Layer w0.254: 14.98,44.32 18.28,41.02 20.82,41.02 25.4,36.39 25.4,35.05 24.63,34.29 22.73,34.29
VDDA: length 21.6
  Top Layer w0.254: 35.37,20.13 33.08,20.13 32.51,19.56 32.51,15.75 28.44,11.68 27.17,11.68 26.42,12.44 26.42,12.95 24.7,12.95 24.7,10.67 26.6,10.67 26.73,10.79
BOOT0: length 39.9
  Top Layer w0.254: v1(24.38,36.58) 23.62,36.58 19.93,40.26 18.41,40.26 16.25,42.42 12.82,42.42 11.68,41.27 R16.2 8.84,41.27 LED2.2 6.61,41.06 Q2.2 ; 39.92,31.68 39.92,33.99 37.33,36.58 v1(37.33,36.7)
  Bottom Layer w0.254: v1(37.33,36.7) 37.21,36.58 v1(24.38,36.58)
D2_2: length 24.5
  Top Layer w0.254: D2.2 3.04,34.54 4.82,36.32 v1(10.03,36.32) 11.55,36.32 11.81,36.07 11.81,33.78 11.93,33.65 12.96,33.65 ; 11.45,45.85 11.45,44.35 v1(11.04,43.94)
  Bottom Layer w0.254: v1(10.03,36.32) 10.03,42.93 v1(11.04,43.94)
L2_1: length 2.7
  Top Layer w0.254: U3.3 61.31,20.71 L2.1
LED1_2: length 1.8
  Top Layer w0.254: R10.2 70.01,1.65 71.84,1.65
OSC25M_IN: length 11.5
  Top Layer w0.254: 24.77,22.48 25.93,23.64 Y1.2 28.54,24.63 35.37,24.63
OSC25M_OUT: length 13.4
  Top Layer w0.254: 24.77,19.05 25.26,19.54 Y1.1 27.55,20.7 30.98,24.13 35.37,24.13
PA0: length 26
  Top Layer w0.254: J1.35 20.06,5.08 23.74,8.76 24.57,8.76 ; 35.37,19.63 33.97,19.63 33.14,18.8 33.14,12.95 32,11.81 30.47,11.81 27.43,8.76 24.38,8.76
PA1: length 27.7
  Top Layer w0.254: 35.37,19.13 34.24,19.13 33.65,18.54 33.65,12.83 32.13,11.3 30.73,11.3 27.68,8.25 23.81,8.25 21.33,5.71 21.33,2.79 J1.36
PA2: length 23.6
  Top Layer w0.254: 35.37,18.63 34.37,18.63 34.16,18.41 34.16,12.57 32.38,10.79 30.8,10.79 27.81,7.75 24,7.75 22.6,6.35 22.6,4.06
PA3: length 24.1
  Top Layer w0.254: 22.6,1.52 24,2.92 24,5.33 25.9,7.24 27.91,7.24 30.96,10.29 32.63,10.29 34.67,12.32 34.67,17.53 35.27,18.13 35.37,18.13
PA4: length 68.8
  Top Layer w0.254: J1.31 25.14,5.71 25.4,6.1 27.43,6.1 30.78,9.52 35.17,9.52 37.92,12.27 U1.28 ; 5.51,25.38 2.39,25.38 v1(1.77,24.76)
  Bottom Layer w0.254: J1.31 25.14,3.17 24.89,2.92 6.73,2.92 1.77,7.87 v1(1.77,24.76)
PA5: length 23.3
  Top Layer w0.254: U1.29 38.42,12.14 35.33,9.04 31.01,9.04 27.3,5.33 26.92,5.33 26.41,4.83 26.41,2.79 J1.32
PA6: length 61.6
  Top Layer w0.254: J1.29 27.68,4.44 31.87,8.64 35.56,8.64 38.92,12 U1.30 ; v1(2.41,19.68) 2.6,19.88 5.51,19.88
  Bottom Layer w0.254: J1.29 27.68,5.08 27.43,5.33 5.27,5.33 2.41,8.2 v1(2.41,19.68)
PA7: length 22.1
  Top Layer w0.254: J1.30 29.08,2.92 29.08,5.08 32,8 35.68,8 39.42,11.74 U1.31
PA8: length 26.2
  Top Layer w0.254: J2.9 54.35,45.59 54.35,41.78 55.34,40.79 55.34,26.8 54.67,26.13 50.47,26.13
PA9: length 48.2
  Top Layer w0.254: J2.10 53.08,41.78 54.61,40.26 v1(54.61,28.45) 54.61,27.05 54.18,26.63 50.47,26.63
  Bottom Layer w0.254: v1(54.61,28.45) 56.64,28.45 65.78,19.3 76.45,19.3 J3.6
PA10: length 51.8
  Top Layer w0.254: 50.47,27.13 52.91,27.13 v1(53.08,27.3) 53.84,28.07 53.84,40.26 51.81,42.29 51.81,45.59 50.54,46.86
  Bottom Layer w0.254: v1(53.08,27.3) 56.13,27.3 66.42,17.02 76.7,17.02
PA11: length 60.1
  Top Layer w0.254: v1(65.65,13.08) 65.65,11.56 67.56,9.65 70.86,9.65 ; v1(48,25.4) 48,26.8 48.83,27.63 52.52,27.63 53.34,28.45 53.34,40 50.54,42.8 50.54,44.32 ; USB.A7 70.98,9.9 70.86,9.78 70.86,9.27 71.2,8.93 USB.B7
  Bottom Layer w0.254: v1(48,25.4) 51.68,25.4 52.45,24.64 55.24,24.64 65.65,14.22 v1(65.65,13.08)
PA12: length 67
  Top Layer w0.254: 48,46.86 49.27,45.59 49.27,43.31 52.83,39.75 52.83,28.57 52.38,28.13 48.45,28.13 47.24,26.92 v1(47.24,26.03) ; 72.87,10.41 75.05,10.41 75.31,10.16 75.31,9.65 75.06,9.41 USB.A6 ; 72.87,10.41 67.38,10.41 66.42,11.37 66.42,14.48 v1(65.78,15.11)
  Bottom Layer w0.254: v1(47.24,26.03) 51.81,26.03 52.7,25.15 55.62,25.15 65.65,15.11 v1(65.78,15.11)
PA13: length 30.4
  Top Layer w0.254: v1(52.19,29.08) 51.74,28.63 50.47,28.63 ; J3.2 75.05,19.56 v1(74.42,20.19)
  Bottom Layer w0.254: v1(74.42,20.19) 65.65,20.19 56.76,29.08 v1(52.19,29.08)
PA14: length 36.9
  Top Layer w0.254: v1(48.13,29.97) 48.92,30.76 48.92,31.68 ; 76.7,17.02 75.43,17.02 74.54,17.91 v1(74.42,17.91)
  Bottom Layer w0.254: v1(74.42,17.91) 66.29,17.91 56.38,27.81 54.1,27.81 53.97,27.94 48.64,27.94 48.13,28.45 v1(48.13,29.97)
PA15: length 12.8
  Top Layer w0.254: 48.42,31.68 48.42,43.9 48,44.32
PB0: length 17.2
  Top Layer w0.254: 32.76,4.06 32.76,5.08 33.9,6.22 36.06,6.22 40.92,11.08 40.92,16.58
PB1: length 19.2
  Top Layer w0.254: 32.76,1.52 34.2,2.96 34.2,4.61 34.92,5.33 35.94,5.33 41.42,10.82 U1.35
PB2: length 40.5
  Top Layer w0.254: J1.23 41.92,10.68 U1.36 ; U2.6 v1(15.36,8.51)
  Bottom Layer w0.254: v1(15.36,8.51) 15.36,6.35 15.74,5.97 34.54,5.97 35.3,5.21 J1.23
PB3: length 18
  Top Layer w0.254: 42.42,31.68 42.42,36.06 36.7,41.78 34.41,41.78 32.76,43.43 32.76,44.32
PB4: length 22.1
  Top Layer w0.254: 41.92,31.68 41.92,35.93 36.57,41.27 33.78,41.27 31.62,43.43 31.62,46.23 30.98,46.86 J2.27
PB5: length 19.8
  Top Layer w0.254: 30.86,44.2 30.73,44.32 J2.28 30.22,43.81 33.27,40.77 36.44,40.77 41.42,35.79 41.42,31.68
PB6: length 72.6
  Top Layer w0.254: 40.92,31.68 40.92,35.27 36.06,40.13 32.63,40.13 28.95,43.81 28.95,45.59 J2.29 ; U2.1 17.9,15.24 17.39,14.73 13.84,14.73 12.06,16.51 12.06,23.49 14.85,26.29 v1(14.85,26.54)
  Bottom Layer w0.254: v1(14.85,26.54) 14.85,27.56 22.22,34.92 40,34.92 v1(40.63,35.56)
PB7: length 51.4
  Top Layer w0.254: 5.51,25.88 6.83,25.88 7.11,26.16 12.57,26.16 13.08,26.67 v1(13.08,26.8) ; J2.30 27.68,44.07 32.25,39.5 35.43,39.5 40.42,34.5 40.42,31.68
  Bottom Layer w0.254: v1(13.08,26.8) 13.08,27.43 27.68,42.04 J2.30
PB8: length 55.4
  Top Layer w0.254: J2.31 26.41,45.59 26.41,43.81 31.24,38.99 34.16,38.99 39.42,33.73 39.42,31.68 ; v1(12.44,27.43) 5.51,27.43 5.51,27.38
  Bottom Layer w0.254: J2.31 26.41,45.59 26.41,43.94 ; v1(12.44,27.43) 12.44,27.81 26.41,41.78 26.41,43.81
PB9: length 49.5
  Top Layer w0.254: J2.32 25.14,44.2 30.98,38.35 34.03,38.35 38.92,33.46 38.92,31.68 ; v1(11.68,26.8) 11.68,26.88 5.51,26.88
  Bottom Layer w0.254: v1(11.68,26.8) 11.68,27.69 25.14,41.15 J2.32
PB10: length 15.7
  Top Layer w0.254: 46.92,16.58 46.92,2.98 J1.16
PB11: length 12.8
  Top Layer w0.254: 48,4.06 47.42,4.64 47.42,16.58
PB12: length 20.1
  Top Layer w0.254: 48,1.52 49.4,2.92 49.4,4.95 52.32,7.87 52.32,17.78 51.94,18.16 50.5,18.16 50.47,18.13
PB13: length 18
  Top Layer w0.254: 50.47,18.63 52.36,18.63 52.83,18.16 52.83,15.49 53.34,14.99 53.34,7.11 50.54,4.32 50.54,4.06
PB14: length 21.8
  Top Layer w0.254: 50.54,1.52 51.81,2.79 51.81,4.7 53.84,6.73 53.84,15.11 53.34,15.62 53.34,18.67 52.83,19.18 50.52,19.18 50.47,19.13
PB15: length 19.3
  Top Layer w0.254: J1.9 53.08,4.95 54.35,6.22 54.35,15.24 53.79,15.8 53.79,19.1 53.26,19.63 50.47,19.63
PC0: length 35.4
  Top Layer w0.254: 14.98,4.06 15.11,4.19 15.11,4.95 16.38,6.22 18.54,6.22 20.57,8.25 20.57,16.26 21.84,17.53 29.21,17.53 29.84,18.16 29.84,21.46 31.51,23.13 35.37,23.13
PC1: length 46.9
  Top Layer w0.254: K3.1 6.85,5.59 8.89,3.56 12.95,3.56 14.98,1.52 16.25,2.79 16.25,4.83 17.01,5.59 18.54,5.59 21.08,8.13 21.08,16.13 21.97,17.02 29.46,17.02 30.35,17.91 30.35,21.21 31.77,22.63 35.37,22.63
PC2: length 32
  Top Layer w0.254: 35.37,22.13 31.91,22.13 30.86,21.08 30.86,17.65 29.71,16.51 22.35,16.51 21.59,15.75 21.59,7.87 17.78,4.06 17.52,4.06
PC3: length 33.7
  Top Layer w0.254: 35.37,21.63 32.17,21.63 31.36,20.83 31.36,17.27 30.09,16 22.73,16 22.09,15.37 22.09,7.75 18.92,4.63 18.92,2.92 17.52,1.52
PC4: length 18
  Top Layer w0.254: J1.27 30.22,4.44 33.27,7.49 35.81,7.49 39.92,11.61 39.92,16.58
PC5: length 20.7
  Top Layer w0.254: J1.28 31.62,2.92 31.62,4.95 33.52,6.86 35.94,6.86 40.42,11.34 40.42,16.58
PC6: length 75.5
  Top Layer w0.254: v1(45.97,24.51) 46.35,24.13 55.49,24.13 57.27,25.91 57.27,40.26 59.43,42.42 59.43,45.59 58.16,46.86 ; v1(11.55,24.76) 6.98,24.76 6.59,24.38 5.51,24.38
  Bottom Layer w0.254: 45.91,24.38 45.91,24.76 v1(11.55,24.76)
PC7: length 72.3
  Top Layer w0.254: 50.47,24.64 47.24,24.64 v1(46.73,25.15) ; 58.16,44.32 58.16,42.04 56.76,40.64 56.76,26.16 55.23,24.63 50.47,24.63 ; v1(7.36,25.4) 7.49,25.53 v1(12.31,25.53) ; 5.51,23.88 6.98,23.88 v1(7.23,24.13)
  Bottom Layer w0.254: v1(7.36,25.4) 7.36,24.26 v1(7.23,24.13) ; v1(46.73,25.15) 46.35,25.53 v1(12.31,25.53)
PC8: length 64.8
  Top Layer w0.254: R6.1 60.19,31.62 61.17,30.65 TF1.7 71.41,30.65 v1(71.88,31.11) ; J2.7 55.88,46.86 56.89,45.85 v1(56.89,41.91) 56.26,41.27 56.26,26.42 54.97,25.13 50.47,25.13
  Bottom Layer w0.254: v1(71.88,31.11) 71.88,39.12 68.7,42.29 57.27,42.29 v1(56.89,41.91)
PC9: length 63.9
  Top Layer w0.254: 50.47,25.63 54.84,25.63 55.75,26.54 55.75,44.32 J2.8 ; v1(72.77,30.86) 71.46,29.55 61.25,29.55 60.96,29.84 R7.1
  Bottom Layer w0.254: v1(72.77,30.86) 72.77,39.12 69.08,42.8 v1(55.88,42.8)
PC10: length 55.3
  Top Layer w0.254: 47.92,31.68 47.92,42.37 46.73,43.56 46.73,45.59 J2.15 ; R3.2 61.21,38.48 62.39,37.3 TF1.1 71.2,37.3 v1(71.24,37.34)
  Bottom Layer w0.254: v1(47.37,42.93) 49.02,41.27 68.96,41.27 71.24,38.99 v1(71.24,37.34)
PC11: length 51.9
  Top Layer w0.254: v1(70.48,36.32) 70.31,36.15 TF1.2 61.89,36.15 61.21,36.83 R4.1 ; J2.16 45.46,43.57 v1(46.92,42.11) 47.42,41.54 47.42,31.68
  Bottom Layer w0.254: 46.99,42.04 48.15,40.87 68.6,40.87 70.48,38.99 v1(70.48,36.32)
PC12: length 53.9
  Top Layer w0.254: 42.92,46.86 43.56,46.86 44.19,46.23 44.19,43.56 46.92,40.83 46.92,31.68 ; TF1.5 69.55,32.85 v1(69.59,32.89)
  Bottom Layer w0.254: v1(69.59,32.89) 69.72,32.89 69.72,39.12 68.45,40.39 47.37,40.39 v1(45.33,42.42)
PC13: length 60
  Top Layer w0.254: v1(72.89,2.67) 73.15,2.67 73.44,2.37 73.44,1.65 ; 35.37,27.13 33.27,27.13 32.51,27.13 32.51,27.18 v1(32.38,27.3)
  Bottom Layer w0.254: v1(72.89,2.67) 72.89,2.92 72.51,3.3 71.5,3.3 66.42,8.38 66.42,16.26 56.26,26.42 52.83,26.42 51.94,27.3 v1(32.38,27.3)
PC14: length 11.6
  Top Layer w0.254: 35.37,26.63 32.04,26.63 29.86,28.81 Y2.2 24.92,28.81 24.77,28.96
PC15: length 11
  Top Layer w0.254: 24.77,25.53 25.55,26.31 Y2.1 27.61,26.13 35.37,26.13
PD0: length 14.1
  Top Layer w0.254: 42.92,44.32 42.92,43.56 46.42,40.06 46.42,31.68
PD1: length 17.5
  Top Layer w0.254: 45.92,31.68 45.92,39.55 41.65,43.81 41.65,45.59 40.38,46.86
PD2: length 55.9
  Top Layer w0.254: R5.1 61.46,35.18 61.59,35.05 TF1.3 69.08,35.05 v1(69.08,35.05) ; 40.38,44.32 40.38,44.07 45.42,39.03 45.42,31.68
  Bottom Layer w0.254: 68.9,35.05 v1(69.08,35.05) 69.08,39.07 69.12,39.07 68.22,39.98 44.47,39.98 v1(42.67,41.78)
PD3: length 65.7
  Top Layer w0.254: 44.92,31.68 44.92,38.13 39.11,43.94 39.11,45.72 37.97,46.86 J2.21 38.22,46.86 ; v1(13.97,26.67) 13.97,26.16 9.65,21.84 5.55,21.84 5.51,21.88
  Bottom Layer w0.254: v1(13.97,26.67) 13.97,27.69 23.87,37.59 43.81,37.59 44.32,38.1 v1(44.32,38.73)
PD4: length 15.4
  Top Layer w0.254: 44.42,31.68 44.42,37.49 37.84,44.07 J2.22
PD5: length 18.8
  Top Layer w0.254: 43.94,31.62 43.94,36.58 36.7,43.81 36.7,45.47 J2.23
PD6: length 16.1
  Top Layer w0.254: 43.42,31.68 43.42,36.44 35.54,44.32 J2.24
PD7: length 20.2
  Top Layer w0.254: 42.92,31.68 42.92,36.19 36.83,42.29 35.43,42.29 34.03,43.69 34.03,45.59 32.76,46.86
PD8: length 23.1
  Top Layer w0.254: 50.47,20.13 53.53,20.13 54.22,19.43 54.22,16 54.99,15.24 54.99,5.46 54.35,4.83 54.35,2.79 J1.10
PD9: length 21.1
  Top Layer w0.254: J1.7 56.13,4.57 56.13,14.86 54.73,16.26 54.73,19.68 53.79,20.63 50.47,20.63
PD10: length 25.1
  Top Layer w0.254: J1.8 57.02,2.92 57.02,14.6 55.24,16.38 55.24,20.07 54.18,21.13 50.47,21.13
PD11: length 72.9
  Top Layer w0.254: v1(16.38,7.37) 14.6,7.37 14.09,7.87 U2.5 ; 50.47,21.63 50.51,21.59 54.48,21.59 55.75,20.32 55.75,16.51 58.29,13.97 58.29,4.19 58.16,4.06
  Bottom Layer w0.254: 16.51,7.24 v1(16.38,7.37) 16.51,7.24 ; 16.51,7.24 57.27,7.24 ; 57.27,7.24 57.09,7.24 ; 57.27,7.24 57.53,7.24 58.16,6.6 58.16,4.06
PD12: length 77.8
  Top Layer w0.254: 58.67,1.78 58.67,1.52 ; U2.2 v1(16.63,15.62) ; 50.47,22.13 54.57,22.13 56.26,20.45 56.26,16.64 59.3,13.59 59.3,2.79 58.16,1.65 58.16,1.52
  Bottom Layer w0.254: v1(59.3,9.14) 17.01,9.14 16.63,9.52 v1(16.63,15.62)
PD13: length 73.6
  Top Layer w0.254: 50.47,22.63 54.71,22.63 56.76,20.57 56.76,16.76 60.07,13.46 60.07,4.7 60.7,4.06 ; v1(17.52,8.25) 17.01,8.25 16.63,8.64 U2.7
  Bottom Layer w0.254: 60.7,4.06 60.57,4.19 60.57,5.59 58.03,8.13 58.03,8.25 v1(17.52,8.25)
PD14: length 93.7
  Top Layer w0.254: 50.47,23.13 v1(55.62,23.11) 57.27,21.46 57.27,17.02 60.57,13.72 60.57,6.73 61.97,5.33 61.97,2.79 60.7,1.52 ; 5.51,26.38 3.39,26.38 v1(3.17,26.16)
  Bottom Layer w0.254: v1(55.62,23.11) 55.62,23.09 20.29,23.09 19.17,21.97 19.17,20.19 18.41,19.43 4.06,19.43 3.04,20.45 3.04,26.03 v1(3.17,26.16)
PD15: length 33
  Top Layer w0.254: 50.47,23.63 45.71,23.63 v1(45.59,23.75) ; v1(19.68,23.49) 19.54,23.63 17.83,23.63
  Top Layer w0.3: 17.85,23.62 LCD.7
  Bottom Layer w0.254: v1(45.59,23.75) 19.68,23.75 v1(19.68,23.49)
PE0: length 58.3
  Top Layer w0.254: 38.42,31.68 38.42,33.33 34.16,37.59 30.22,37.59 23.87,43.94 23.87,45.59 22.6,46.86 ; 5.51,23.38 8.14,23.38 8.89,24.13 v1(10.79,24.13)
  Bottom Layer w0.254: v1(10.79,24.13) 10.79,27.43 23.87,40.51 23.87,45.59 22.6,46.86
PE1: length 52.3
  Top Layer w0.254: 5.51,22.88 8.4,22.88 8.89,23.37 v1(10.16,23.37) ; 37.92,31.68 37.92,33 33.84,37.08 29.97,37.08 22.73,44.32 22.6,44.32
  Bottom Layer w0.254: 22.6,44.32 22.6,40 10.16,27.56 v1(10.16,23.37)
PE2: length 58.9
  Top Layer w0.254: v1(15.74,26.42) 15.74,26.29 12.7,23.24 12.7,16.64 13.84,15.49 15.23,15.49 15.36,15.62 U2.3 ; J2.35 21.33,45.59 21.33,43.94 35.14,30.13 35.37,30.13
  Bottom Layer w0.254: v1(15.74,26.42) 15.74,27.81 21.2,33.27 v1(32,33.27)
PE3: length 21.6
  Top Layer w0.254: J2.36 20.19,44.32 31.24,33.27 31.24,32.89 34.5,29.63 35.37,29.63
PE4: length 59.3
  Top Layer w0.254: 5.51,22.38 9.17,22.38 v1(9.52,22.73) ; 35.37,29.13 34.24,29.13 30.47,32.89 30.47,33.4 21.08,42.8 19.93,42.8 18.92,43.81 18.92,45.47 17.52,46.86
  Bottom Layer w0.254: 17.52,46.86 17.78,46.86 18.79,45.85 18.79,36.96 9.52,27.69 v1(9.52,22.73)
PE5: length 55.1
  Top Layer w0.254: 5.51,21.38 8.46,21.38 v1(8.63,21.21) ; 35.37,28.63 33.85,28.63 29.97,32.51 29.97,33.15 20.95,42.16 19.05,42.16 17.52,43.69 17.52,44.32
  Bottom Layer w0.254: 17.52,44.32 17.52,36.26 8.63,27.37 v1(8.63,21.21)
PE6: length 62.8
  Top Layer w0.254: v1(7.87,20.7) 7.69,20.88 5.51,20.88 ; 14.98,46.86 15.49,46.86 16.38,45.97 16.38,43.81 18.54,41.66 20.82,41.66 29.46,33.02 29.46,32.26 33.59,28.13 35.37,28.13
  Bottom Layer w0.254: 14.98,46.86 15.23,46.86 16.38,45.72 16.38,36.07 8,27.69 8,20.7 v1(7.87,20.7)
PE7: length 18
  Top Layer w0.254: U1.37 42.42,10.29 36.57,4.44 36.57,2.79 J1.24
PE8: length 14.6
  Top Layer w0.254: U1.38 42.92,9.14 J1.21
PE9: length 17.4
  Top Layer w0.254: J1.22 39.11,2.79 39.11,4.57 43.42,8.88 43.42,16.58
PE10: length 14
  Top Layer w0.254: 40.38,4.06 40.38,4.19 43.92,7.73 43.92,16.58
PE11: length 50.5
  Top Layer w0.254: v1(43.68,18.92) 44.42,18.18 44.42,7.22 41.52,4.32 41.52,2.62 41.48,2.62 40.38,1.52 ; v1(21.2,19.05) 21.2,24 20.57,24.64 LCD.5
  Bottom Layer w0.254: v1(21.2,19.05) 43.56,19.05 v1(43.68,18.92)
PE12: length 45.5
  Top Layer w0.254: 42.92,4.06 44.92,6.06 U1.42 44.92,19.08 v1(44.32,19.68)
  Top Layer w0.3: LCD.9 19.27,22.63 19.81,22.1 v1(19.81,20.19)
  Bottom Layer w0.254: v1(44.32,19.68) 20.31,19.68 v1(19.81,20.19)
PE13: length 16.1
  Top Layer w0.254: 42.92,1.52 44.19,2.79 44.19,4.7 45.42,5.93 U1.43
PE14: length 48
  Top Layer w0.254: 45.97,4.06 45.92,4.11 ; v1(44.7,20.45) 45.92,19.23 U1.44 45.92,4.52 J1.15 ; LCD.4 21.09,25.13 21.97,24.26 v1(21.97,20.7)
  Bottom Layer w0.3: v1(44.7,20.45) 22.22,20.45 v1(21.97,20.7)
PE15: length 35.1
  Top Layer w0.254: v1(20.57,21.46) 20.57,23.88 20.31,24.13 19.3,24.13 LCD.6 ; v1(46.48,19.68) 46.42,19.63 U1.45
  Bottom Layer w0.254: v1(46.48,19.68) 46.48,19.81 44.83,21.46 v1(20.57,21.46)
PWR1_2: length 2
  Top Layer w0.254: PWR1.2 69.89,46.23 R9.2
Q1_1: length 39.3
  Top Layer w0.254: 14.47,33.65 14.47,34.42 13.97,34.92 v1(12.95,34.92) 12.95,36.31 13.09,36.45 ; 4.2,9.59 2.02,9.59 C20.2
  Top Layer w0.3: C20.2 1.01,10.1 1.01,26.16 v1(2.41,27.56)
  Bottom Layer w0.3: v1(12.95,34.92) 12.19,34.92 8.89,31.62 6.47,31.62 v1(2.41,27.56)
Q2_1: length 11.5
  Top Layer w0.254: C21.2 11.74,38.42 11.81,38.35 7.41,38.35 Q2.1 3.74,39.18 3.04,38.48 D2.1
R2_2: length 9
  Top Layer w0.254: 73.78,22.1 v1(74.54,22.1) 72,22.1 71.75,21.84 71.75,19.94 71.5,19.68 70.6,19.68
  Bottom Layer w0.254: v1(74.54,22.1) 76.7,22.1
R8_2: length 4.1
  Top Layer w0.254: 68.97,8.78 R8.2 69.97,8.76 70.34,8.39 USB.A5
R11_1: length 4.4
  Top Layer w0.254: USB.B5 69.74,11.4 69.21,11.94 R11.1 69.1,11.78
R15_2: length 5.1
  Top Layer w0.254: 4.58,40.13 4.58,41.39 v1(4.44,41.53) ; R15.2 1.27,41.02 v1(1.77,41.53)
  Bottom Layer w0.254: v1(1.77,41.53) v1(4.44,41.53)
R18_2: length 14.1
  Top Layer w0.254: 64.7,18.4 63.69,17.4 v1(61.08,17.4) ; v1(61.08,14.48) 61.08,12.57 62.72,12.57 62.72,10.82 R17.1 62.87,9.02
  Bottom Layer w0.254: v1(61.08,14.48) v1(61.08,17.4)
RST: length 89.7
  Top Layer w0.254: 13.33,6.73 18.41,6.73 20.06,8.39 20.06,9.16 ; 13.84,6.73 12.07,6.73 11.04,7.75 ; v1(70.35,22.61) 69.09,21.34 R2.1 ; K2.2 10.41,7.12 11.04,7.75 ; 11.04,7.75 10.99,7.81 C18.2 7.03,7.81 6.2,8.64 ; v1(38.35,26.67) 38.35,25.4 36.58,23.63 31.37,23.63 29.33,21.59 29.33,18.41 28.93,18.01 21.56,18.01 20.06,16.51 20.06,9.14 ; v1(57.02,24.64) 59.81,24.64 v1(61.08,25.91)
  Bottom Layer w0.254: v1(57.02,24.64) 55.88,25.78 52.7,25.78 51.81,26.67 v1(38.35,26.67) ; v1(70.35,22.61) 67.05,25.91 v1(61.08,25.91)
U1_6: length 19.4
  Top Layer w0.254: D1.3 25.71,33.4 25.71,34.67 27.17,34.67 28.95,32.89 28.95,32 33.33,27.63 35.37,27.63
U1_48: length 5.4
  Top Layer w0.254: 47.92,16.58 47.92,11.7 48.25,11.37
U1_73: length 11
  Top Layer w0.254: 59.43,27.24 59.43,27.56 v1(58.67,28.32) ; v1(52.19,30.23) 52.19,29.97 51.35,29.13 50.47,29.13
  Bottom Layer w0.254: v1(52.19,30.23) 56.76,30.23 v1(58.67,28.32)
VREF: length 17.4
  Top Layer w0.254: 35.37,20.63 32.18,20.63 31.87,20.32 31.87,16.13 28.7,12.95 27.93,12.95 26.6,14.28 C3.2 24.7,14.86

## Copper pours and planes (outline as drawn; the poured copper is in the pictures)
GND on Top Layer: -0.13,48.13 -0.13,-0.13 80.13,-0.13 80.13,48.13
GND on Bottom Layer: -0.13,48.13 -0.13,-0.13 79.88,-0.13 80.13,0.13 80.13,48.13

Small or netless copper shapes (teardrops, artwork), in the pictures only: 1036 on Top Layer, 234 on Bottom Layer

## Text on the board
Bottom Silkscreen Layer: www.genbotter.com | 001 | D-B-X-X-00028 | VB | E6 | E4 | E5 | E3 | E2 | E0 | E1 | B8 | B9 | B6 | B7 | B4 | B5 | D7 | B3 | D5 | D6 | D3 | D4 | D2 | D1 | C12 | D0 | C10 | C11 | A12 | A15 | A10 | A11 | A8 | A9 | C8 | C9 | C6 | C7 | 3V3 | 5V | RST | TX | RX | C1 | C0 | C2 | C3 | A1 | A0 | A2 | A3 | A4 | A5 | A6 | A7 | C4 | C5 | B1 | B0 | B2 | E7 | E8 | E9 | E11 | E10 | E12 | E13 | E14 | B10 | B11 | B12 | B13 | B14 | D8 | B15 | D9 | D10 | D11 | D12 | D14 | D13 | GND | DRG ST-5 STM32H750VBT6 V1.0
Top Silkscreen Layer: BOOT0 | C0 | C1 | C2 | C3 | A0 | A1 | A2 | A3 | A4 | A5 | A7 | A6 | C4 | C5 | B0 | B1 | B2 | E7 | E8 | E9 | E10 | E11 | E12 | E13 | E14 | B10 | B11 | B12 | B13 | B14 | B15 | D8 | D10 | D9 | D11 | D12 | D13 | D14 | GND | SD | RST | E6 | VB | E4 | E5 | E3 | E2 | E1 | E0 | B8 | B9 | B6 | B7 | B4 | B5 | D7 | B3 | D5 | D6 | D3 | D4 | D1 | D2 | D0 | C12 | C11 | C10 | A15 | A12 | A11 | A10 | A8 | A9 | C8 | C9 | C6 | C7 | 3V3 | 5V | FLASH | DIO | CLK
